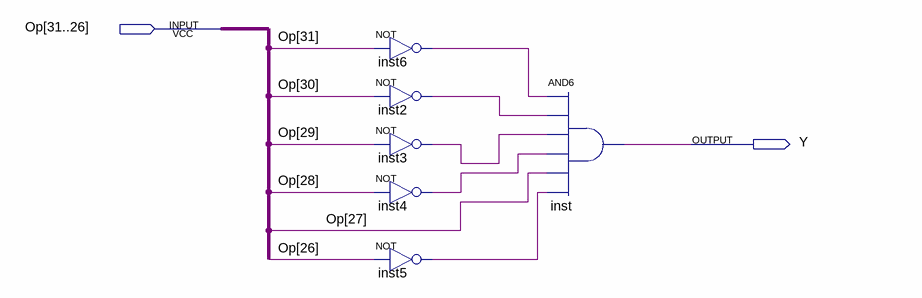
[diagram p0: schematic sheet]
// Quartus schematic J.bdf as structural Verilog: 6 symbols, 2 pins
module J (
  input  [31:26] Op,
  output Y
);

  wire inst2_out, inst3_out, inst4_out, inst5_out, inst6_out;

  not inst6 (inst6_out, Op[31]);
  not inst2 (inst2_out, Op[30]);
  not inst3 (inst3_out, Op[29]);
  not inst4 (inst4_out, Op[28]);
  not inst5 (inst5_out, Op[26]);
  and inst (Y, inst6_out, inst2_out, inst3_out, inst4_out, Op[27], inst5_out);
endmodule
